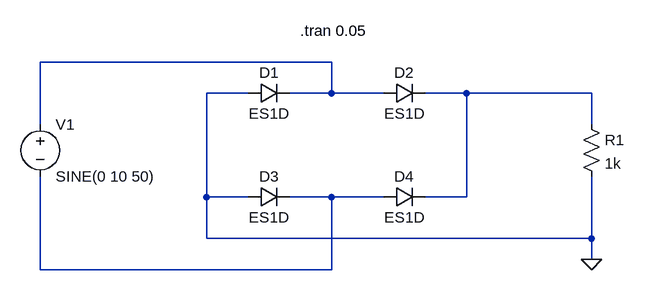
[diagram p0: schematic task_3.asc]
task_3.asc, the LTspice schematic file:
Version 4
SHEET 1 1048 680
WIRE 592 0 144 0
WIRE 464 48 400 48
WIRE 592 48 592 0
WIRE 592 48 528 48
WIRE 672 48 592 48
WIRE 800 48 736 48
WIRE 992 48 800 48
WIRE 144 96 144 0
WIRE 992 96 992 48
WIRE 400 208 400 48
WIRE 464 208 400 208
WIRE 592 208 528 208
WIRE 672 208 592 208
WIRE 800 208 800 48
WIRE 800 208 736 208
WIRE 400 272 400 208
WIRE 992 272 992 176
WIRE 992 272 400 272
WIRE 992 304 992 272
WIRE 144 320 144 176
WIRE 592 320 592 208
WIRE 592 320 144 320
FLAG 992 304 0
SYMBOL voltage 144 80 R0
WINDOW 123 0 0 Left 0
WINDOW 39 0 0 Left 0
SYMATTR InstName V1
SYMATTR Value SINE(0 10 50)
SYMBOL diode 464 64 R270
WINDOW 0 32 32 VTop 2
WINDOW 3 0 32 VBottom 2
SYMATTR InstName D1
SYMATTR Value ES1D
SYMBOL res 976 80 R0
SYMATTR InstName R1
SYMATTR Value 1k
SYMBOL diode 672 64 R270
WINDOW 0 32 32 VTop 2
WINDOW 3 0 32 VBottom 2
SYMATTR InstName D2
SYMATTR Value ES1D
SYMBOL diode 672 224 R270
WINDOW 0 32 32 VTop 2
WINDOW 3 0 32 VBottom 2
SYMATTR InstName D4
SYMATTR Value ES1D
SYMBOL diode 464 224 R270
WINDOW 0 32 32 VTop 2
WINDOW 3 0 32 VBottom 2
SYMATTR InstName D3
SYMATTR Value ES1D
TEXT 544 -48 Left 2 !.tran 0.05

The netlist it stands for:
* task_3.asc
V1 N001 N003 SINE(0 10 50)
D1 0 N001 ES1D
R1 N002 0 1k
D2 N001 N002 ES1D
D4 N003 N002 ES1D
D3 0 N003 ES1D
.model D D
.lib standard.dio
.tran 0.05
.backanno
.end